# EAGLE design Uebungsboard2017 (EAGLE 8.3.1)
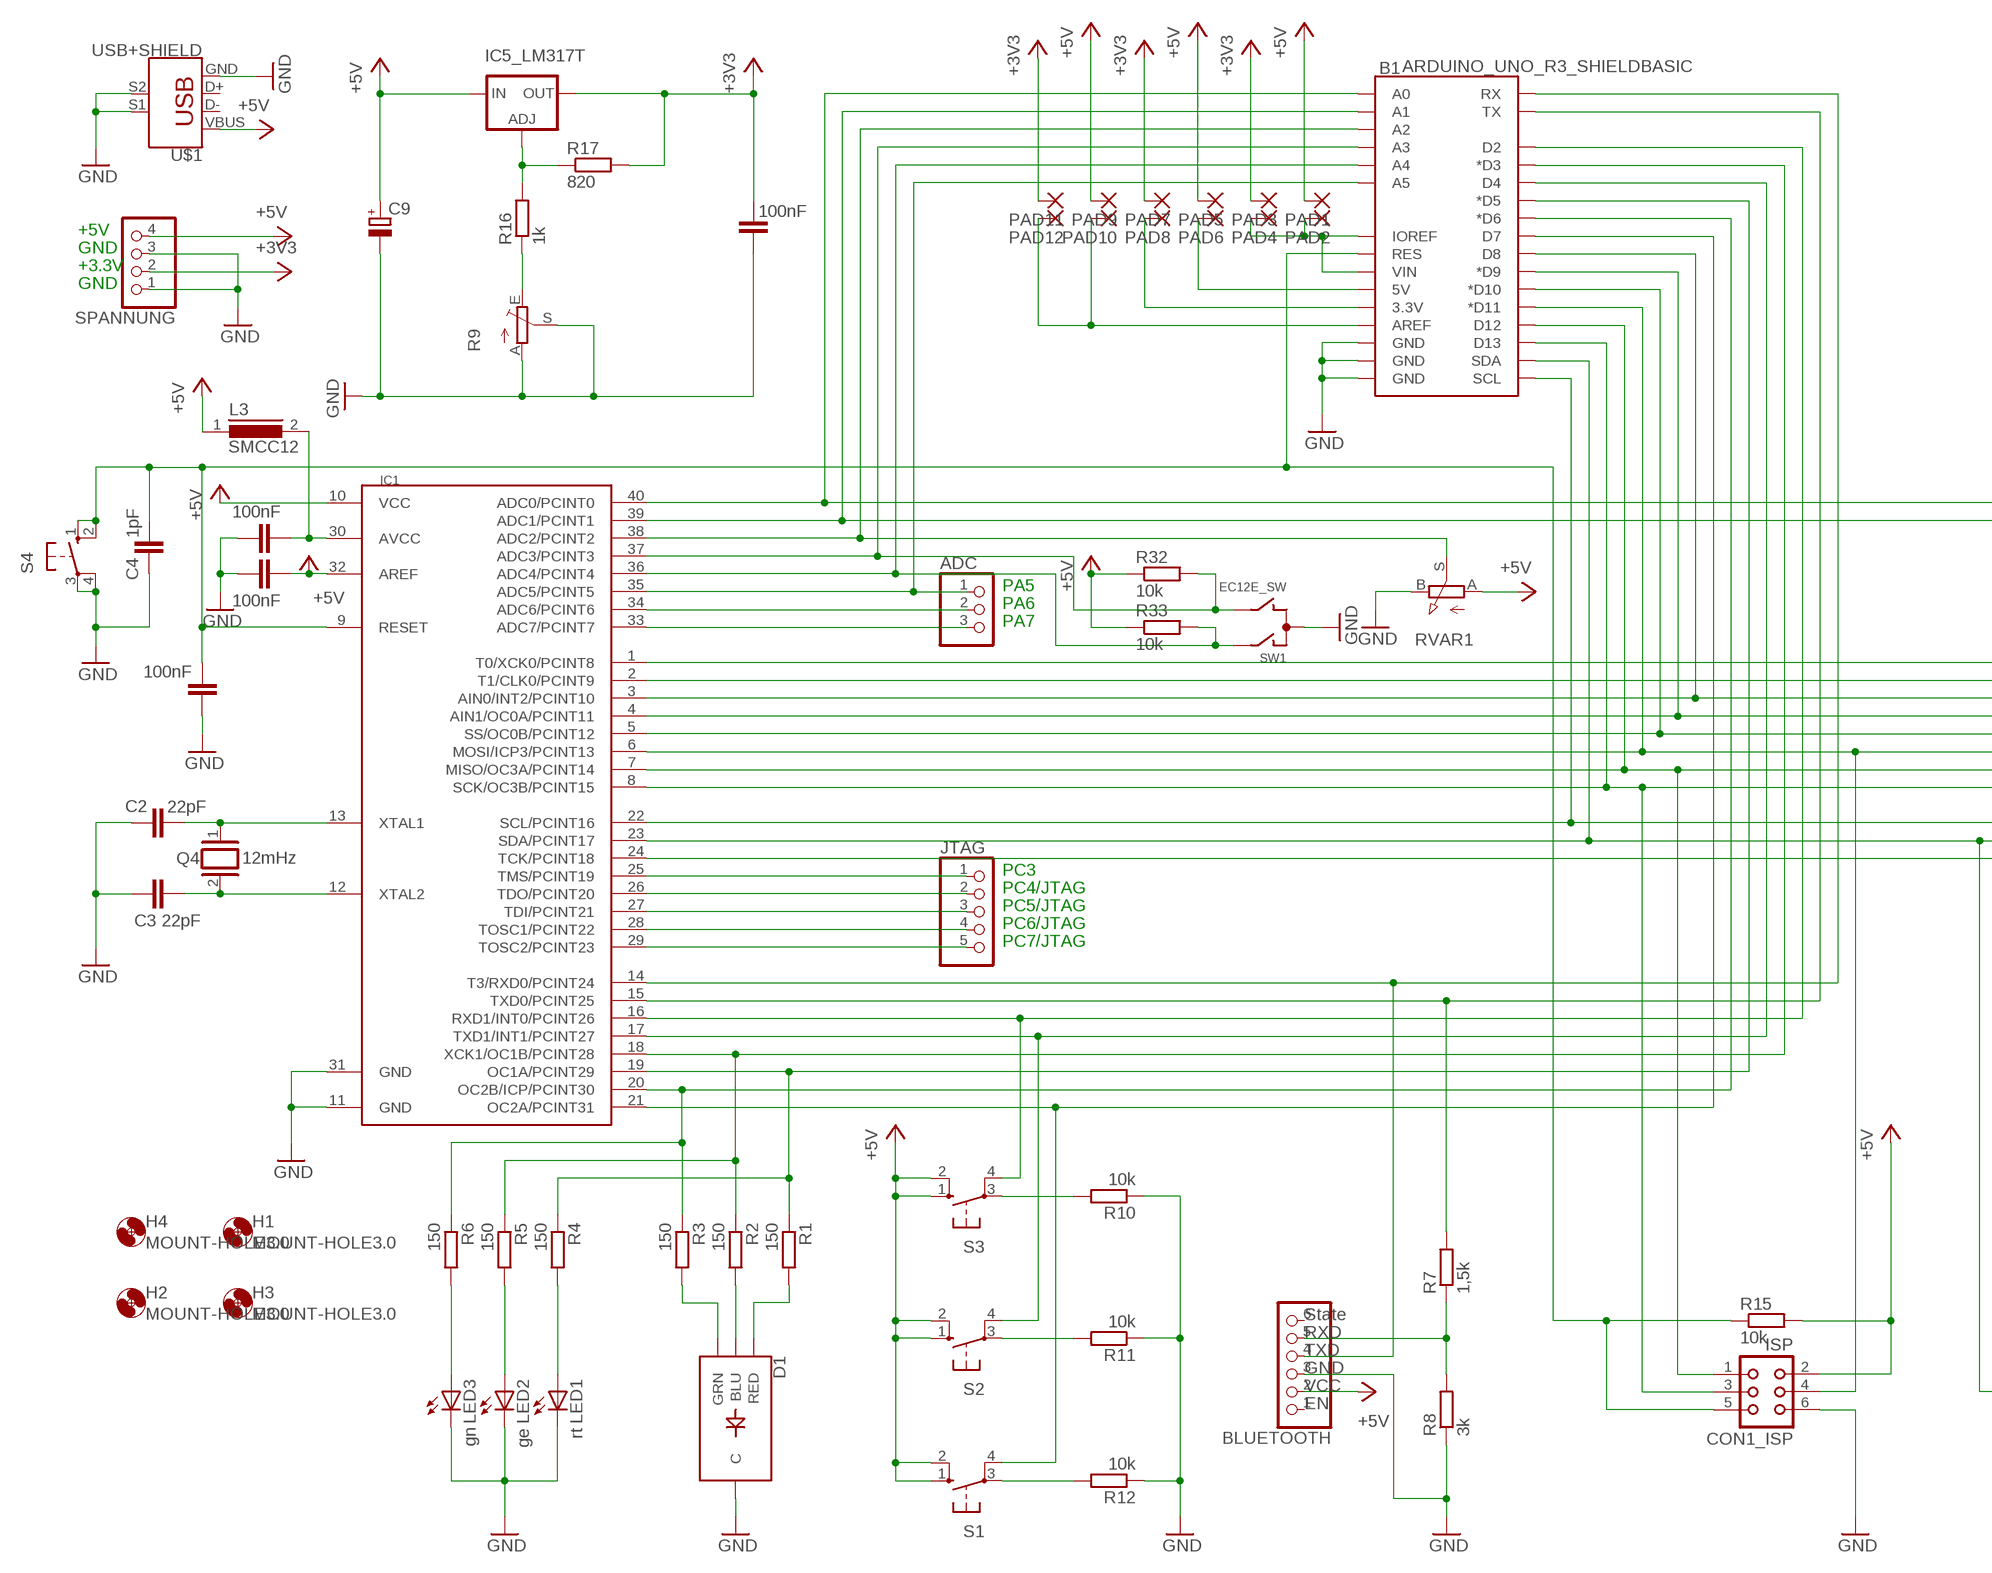
[diagram p0: schematic, sheet 1, part 1 of 2]
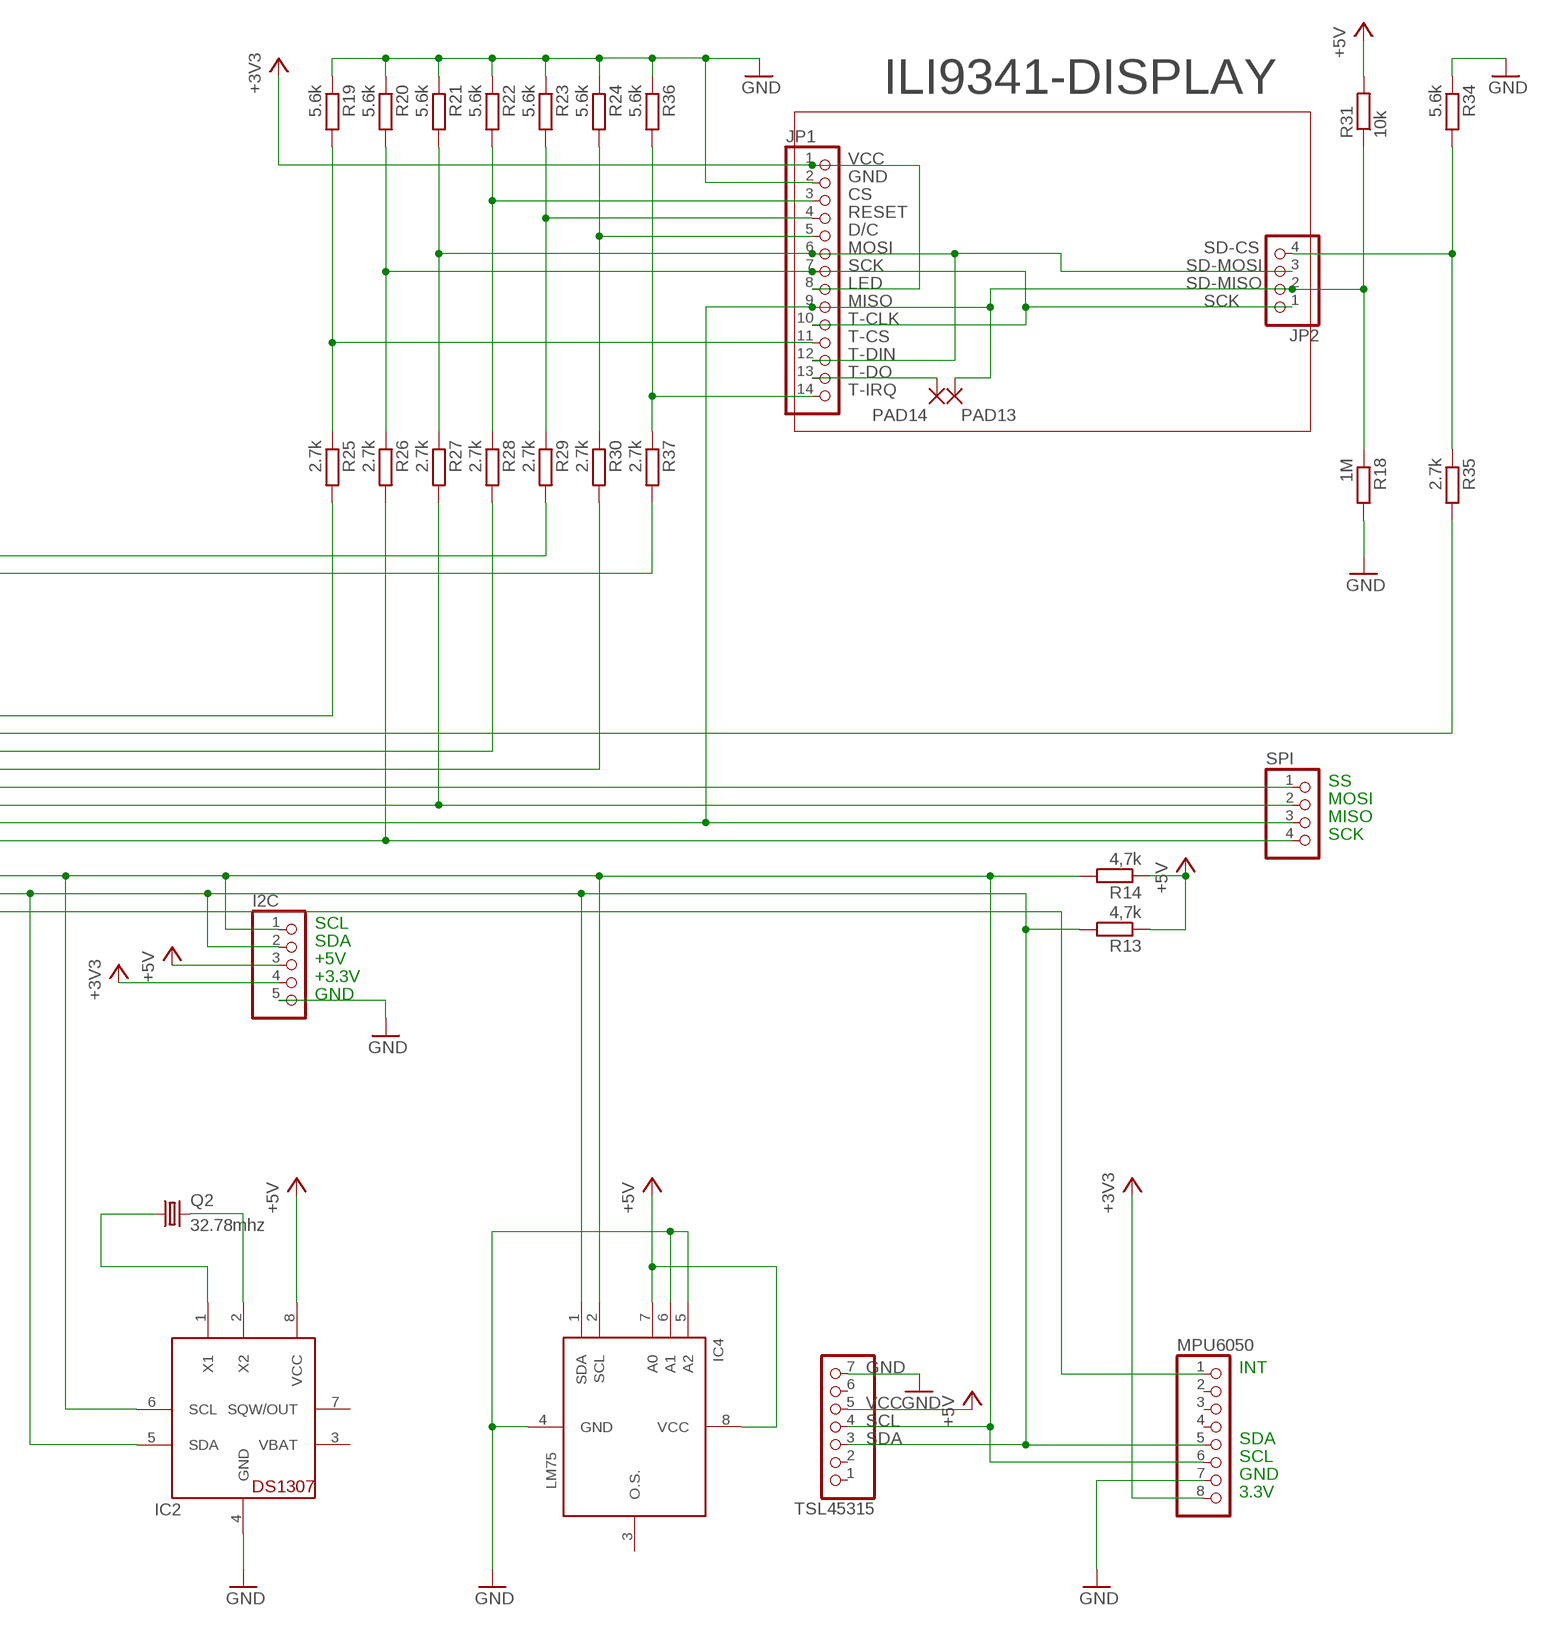
[diagram p1: schematic, sheet 1, part 2 of 2]

## Parts
ADC  PINHD-1X3  [1X03]
B1  ARDUINO_UNO_R3_SHIELDBASIC  [UNO_R3_SHIELD]
BLUETOOTH  PINHD-1X6  [1X06]
C2  22pF  C5/2.5  [C5B2.5]
C3  22pF  C5/2.5  [C5B2.5]
C4  1pF  C5/2.5  [C5B2.5]
C5  100nF  C5/2.5  [C5B2.5]
C6  100nF  C5/2.5  [C5B2.5]
C7  100nF  C5/2.5  [C5B2.5]
C8  100nF  C5/2.5  [C5B2.5]
C9  CPOL-EUE2-5  [E2-5]
CON1_ISP  ISP  CON06  [CON06]
D1  LED-RGB-CCTEST  [LED-RGB-THRU]
H1  MOUNT-HOLE3.0  [3,0]
H2  MOUNT-HOLE3.0  [3,0]
H3  MOUNT-HOLE3.0  [3,0]
H4  MOUNT-HOLE3.0  [3,0]
I2C  PINHD-1X5  [1X05]
IC1  MEGA1284P  [DIL40]
IC2  DS1307  [DIL08]
IC4  DS1721S  [SO-8]
IC5_LM317T  3.3V  LM317TS  [317TS]
JP1  PINHD-1X14  [1X14]
JP2  PINHD-1X4  [1X04]
JTAG  PINHD-1X5  [1X05]
L3  SMCC12  [SMCC12]
LED1  rt  LED5MM  [LED5MM]
LED2  ge  LED5MM  [LED5MM]
LED3  gn  LED5MM  [LED5MM]
MPU6050  PINHD-1X8  [1X08]
PAD1  1,6/0,8  [1,6/0,8]
PAD2  1,6/0,8  [1,6/0,8]
PAD3  1,6/0,8  [1,6/0,8]
PAD4  1,6/0,8  [1,6/0,8]
PAD5  1,6/0,8  [1,6/0,8]
PAD6  1,6/0,8  [1,6/0,8]
PAD7  1,6/0,8  [1,6/0,8]
PAD8  1,6/0,8  [1,6/0,8]
PAD9  1,6/0,8  [1,6/0,8]
PAD10  1,6/0,8  [1,6/0,8]
PAD11  1,6/0,8  [1,6/0,8]
PAD12  1,6/0,8  [1,6/0,8]
PAD13  1,6/0,8  [1,6/0,8]
PAD14  1,6/0,8  [1,6/0,8]
Q2  32.78mhz  CRYSTALTC26H  [TC26H]
Q4  12mHz  XTAL/S  [QS]
R1  150  R-EU_0207/10  [0207/10]
R2  150  R-EU_0207/10  [0207/10]
R3  150  R-EU_0207/10  [0207/10]
R4  150  R-EU_0207/10  [0207/10]
R5  150  R-EU_0207/10  [0207/10]
R6  150  R-EU_0207/10  [0207/10]
R7  1,5k  R-EU_0207/10  [0207/10]
R8  3k  R-EU_0207/10  [0207/10]
R9  TRIM_EU-S63P  [S63P]
R10  10k  R-EU_0207/10  [0207/10]
R11  10k  R-EU_0207/10  [0207/10]
R12  10k  R-EU_0207/10  [0207/10]
R13  4,7k  R-EU_0207/10  [0207/10]
R14  4,7k  R-EU_0207/10  [0207/10]
R15  10k  R-EU_0207/10  [0207/10]
R16  1k  R-EU_0207/10  [0207/10]
R17  820  R-EU_0207/10  [0207/10]
R18  1M  R-EU_0207/10  [0207/10]
R19  5.6k  R-EU_0207/10  [0207/10]
R20  5.6k  R-EU_0207/10  [0207/10]
R21  5.6k  R-EU_0207/10  [0207/10]
R22  5.6k  R-EU_0207/10  [0207/10]
R23  5.6k  R-EU_0207/10  [0207/10]
R24  5.6k  R-EU_0207/10  [0207/10]
R25  2.7k  R-EU_0207/10  [0207/10]
R26  2.7k  R-EU_0207/10  [0207/10]
R27  2.7k  R-EU_0207/10  [0207/10]
R28  2.7k  R-EU_0207/10  [0207/10]
R29  2.7k  R-EU_0207/10  [0207/10]
R30  2.7k  R-EU_0207/10  [0207/10]
R31  10k  R-EU_0207/10  [0207/10]
R32  10k  R-EU_0207/10  [0207/10]
R33  10k  R-EU_0207/10  [0207/10]
R34  5.6k  R-EU_0207/10  [0207/10]
R35  2.7k  R-EU_0207/10  [0207/10]
R36  5.6k  R-EU_0207/10  [0207/10]
R37  2.7k  R-EU_0207/10  [0207/10]
RVAR1  RK09K113  [RK09K113]
S1  10-XX  [B3F-10XX]
S2  10-XX  [B3F-10XX]
S3  10-XX  [B3F-10XX]
S4  10-XX  [B3F-10XX]
SPANNUNG  PINHD-1X4  [1X04]
SPI  PINHD-1X4  [1X04]
SW1  EC12E_SW  [ALPS_EC12E_SW]
TSL45315  PINHD-1X7  [1X07]
U$1  USB+SHIELD  [USB-B-PTH]

## Nets
+3V3: C5.1 I2C.4 IC5_LM317T.2(OUT) JP1.1 JP1.8 MPU6050.8 PAD3.1(P) PAD7.1(P) PAD11.1(P) R17.2 SPANNUNG.2
+5V: BLUETOOTH.2 C6.1 C9.+ CON1_ISP.2 I2C.3 IC1.10(VCC) IC1.32(AREF) IC2.8(VCC) IC4.7(A0) IC4.8(VCC) IC5_LM317T.3(IN) L3.1 PAD1.1(P) PAD5.1(P) PAD9.1(P) R13.1 R14.1 R15.2 R31.2 R32.1 R33.1 RVAR1.A S1.1(S) S1.2(S1) S2.1(S) S2.2(S1) S3.1(S) S3.2(S1) SPANNUNG.4 TSL45315.5 U$1.VBUS
GND: B1.GND@0(GND) B1.GND@1(GND) B1.GND@2(GND) BLUETOOTH.3 C2.2 C3.1 C4.2 C5.2 C6.2 C7.2 C8.2 C9.- CON1_ISP.6 D1.2(C) I2C.5 IC1.11(GND) IC1.31(GND) IC2.4(GND) IC4.4(GND) IC4.5(A2) IC4.6(A1) JP1.2 LED1.K(C) LED2.K(C) LED3.K(C) MPU6050.7 R8.1 R9.A R9.S R10.1 R11.1 R12.1 R18.2 R19.1 R20.1 R21.1 R22.1 R23.1 R24.1 R34.1 R36.1 RVAR1.B(E) S4.3(P) S4.4(P1) SPANNUNG.1 SPANNUNG.3 SW1.C TSL45315.7 U$1.GND U$1.S1 U$1.S2
N$1: B1.D5(*D5) IC1.19(OC1A/PCINT29) R1.1 R4.1
N$2: C2.1 IC1.13(XTAL1) Q4.1
N$3: B1.D3(*D3) IC1.18(XCK1/OC1B/PCINT28) R2.1 R5.1
N$4: C3.2 IC1.12(XTAL2) Q4.2
N$5: B1.D6(*D6) IC1.20(OC2B/ICP/PCINT30) R3.1 R6.1
N$6: D1.1(RED) R1.2
N$7: D1.4(BLU) R2.2
N$8: D1.3(GRN) R3.2
N$9: LED1.A R4.2
N$10: LED2.A R5.2
N$11: LED3.A R6.2
N$12: B1.D12 CON1_ISP.1 IC1.7(MISO/OC3A/PCINT14) JP1.9 JP2.2 PAD13.1(P) R18.1 R31.1 SPI.3
N$13: ADC.1 B1.A5 IC1.35(ADC5/PCINT5)
N$14: IC2.2(X2) Q2.2
N$15: B1.D11(*D11) CON1_ISP.4 IC1.6(MOSI/ICP3/PCINT13) R27.2 SPI.2
N$16: B1.A1 IC1.39(ADC1/PCINT1) R37.2
N$17: IC1.24(TCK/PCINT18) MPU6050.1
N$18: B1.A2 IC1.38(ADC2/PCINT2) RVAR1.S
N$19: IC5_LM317T.1(ADJ) R16.2 R17.1
N$20: IC2.1(X1) Q2.1
N$21: B1.RX BLUETOOTH.4 IC1.14(T3/RXD0/PCINT24)
N$22: BLUETOOTH.5 R7.1 R8.2
N$23: B1.SCL I2C.1 IC1.22(SCL/PCINT16) IC2.6(SCL) IC4.2(SCL) MPU6050.6 R14.2 TSL45315.4
N$24: B1.D4 IC1.17(TXD1/INT1/PCINT27) S2.4(P1)
N$25: B1.D2 IC1.16(RXD1/INT0/PCINT26) S3.4(P1)
N$26: R10.2 S3.3(P)
N$27: R11.2 S2.3(P)
N$28: R12.2 S1.3(P)
N$29: C7.1 IC1.30(AVCC) L3.2
N$30: B1.TX IC1.15(TXD0/PCINT25) R7.2
N$31: JP1.11 R19.2 R25.1
N$32: IC1.25(TMS/PCINT19) JTAG.1
N$33: R9.E R16.1
N$34: JP1.7 JP1.10 JP2.1 R20.2 R26.1
N$35: JP1.6 JP1.12 JP2.3 R21.2 R27.1
N$36: JP1.3 R22.2 R28.1
N$37: JP1.4 R23.2 R29.1
N$38: JP1.5 R24.2 R30.1
N$39: B1.A4 IC1.36(ADC4/PCINT4) R33.2 SW1.A
N$40: IC1.1(T0/XCK0/PCINT8) R25.2
N$41: B1.D8 IC1.3(AIN0/INT2/PCINT10) R28.2
N$42: B1.A0 IC1.40(ADC0/PCINT0) R29.2
N$43: B1.D9(*D9) IC1.4(AIN1/OC0A/PCINT11) R30.2
N$44: B1.A3 IC1.37(ADC3/PCINT3) R32.2 SW1.B
N$45: JP2.4 R34.2 R35.1
N$46: IC1.2(T1/CLK0/PCINT9) R35.2
N$47: IC1.26(TDO/PCINT20) JTAG.2
N$48: IC1.27(TDI/PCINT21) JTAG.3
N$49: IC1.28(TOSC1/PCINT22) JTAG.4
N$50: B1.D13 CON1_ISP.3 IC1.8(SCK/OC3B/PCINT15) R26.2 SPI.4
N$52: B1.D10(*D10) IC1.5(SS/OC0B/PCINT12) SPI.1
N$53: B1.D7 IC1.21(OC2A/PCINT31) S1.4(P1)
N$54: IC1.29(TOSC2/PCINT23) JTAG.5
N$55: B1.IOREF B1.VIN PAD2.1(P) PAD4.1(P)
N$56: B1.5V PAD6.1(P)
N$57: B1.3.3V PAD8.1(P)
N$58: B1.AREF PAD10.1(P) PAD12.1(P)
N$59: ADC.2 IC1.34(ADC6/PCINT6)
N$60: ADC.3 IC1.33(ADC7/PCINT7)
N$61: JP1.13 PAD14.1(P)
N$62: B1.RES C4.1 C8.1 CON1_ISP.5 IC1.9(RESET) R15.1 S4.1(S) S4.2(S1)
N$63: JP1.14 R36.2 R37.1
N$64: B1.SDA I2C.2 IC1.23(SDA/PCINT17) IC2.5(SDA) IC4.1(SDA) MPU6050.5 R13.2 TSL45315.3
Unconnected: BLUETOOTH.1 BLUETOOTH.6 IC2.7(SQW/OUT) IC4.3(O.S.) MPU6050.2 MPU6050.3 MPU6050.4 SW1.D SW1.E SW1.GND1(G) SW1.GND2(G) TSL45315.1 TSL45315.2 TSL45315.6 U$1.D+ U$1.D-

## Notes on the sheet
- ILI9341-DISPLAY
- VCC
- GND
- CS
- RESET
- D/C
- MOSI | SD-CS
- SCK | SD-MOSI
- +5V | LED | SD-MISO
- GND | MISO | SCK
- +3.3V | T-CLK
- GND | T-CS
- T-DIN
- T-DO
- T-IRQ
- PA5
- PA6
- PA7
- SS
- MOSI
- MISO
- SCK
- PC3 | SCL
- PC4/JTAG | SDA
- PC5/JTAG | +5V
- PC6/JTAG | +3.3V
- PC7/JTAG | GND
- State | GND | INT
- RXD
- TXD | VCC
- GND | SCL
- VCC | SDA | SDA
- EN | SCL
- GND
- 3.3V

## Power pins joined to a net without a drawn wire
VBAT: IC2.3(VBAT)

## Library data of the parts
ADC = pinhead:PINHD-1X3: PIN HEADER
B1 = SparkFun-Boards:ARDUINO_UNO_R3_SHIELD: Arduino R3 Shield Footprint Shield form compatible with the Arduino Uno R3. SparkFun Products: MG2639 Cellular Shield <https://www.sparkfun.com/products/13120> MIDI Shield <https://www.sparkfun.com/products/12898> R3 Stackable Headers Kit <https://www.sparkfun.com/products/11417>
BLUETOOTH = pinhead:PINHD-1X6: PIN HEADER
C2-C8 = capacitor-wima:C: CAPACITOR naming: grid - package width
C9 = rcl:CPOL-EU: POLARIZED CAPACITOR, European symbol
CON1_ISP = con-harting:CON06: CONNECTOR; OC_FARNELL: unknown; OC_NEWARK: unknown
D1 = SparkFun-LED3:LED-RGB-CC: LED-RGB Common Cathode Packages: LED RGB-THRU LED_PIRANHA_5MM SparkFun Products: RGB Diffused Common Cathode- Diffuse <[https://www.sparkfun.com/products/9264]> RGB Diffused Common Cathode - Clear <[https://www.sparkfun.com/products/105]> LED-RGB 5mm Square (Piranha) <[https://www.sparkfun.com/products/11679]>
H1-H4 = holes:MOUNT-HOLE: MOUNTING HOLE with drill center marker
I2C JTAG = pinhead:PINHD-1X5: PIN HEADER
IC1 = 1284p:MEGA1284P: Atmel ATmega1284P 8-bit AVR Microcontroller
IC2 = adafruit:DS1307: DS1307 Real time clock (RTC) with battery backup ability. Talk to it via i2c
IC4 = LM75:DS1721: Temperatursensor / Thermostat mit I²C-Interface
IC5_LM317T = v-reg:LM317TS: VOLTAGE REGULATOR
JP1 = pinhead:PINHD-1X14: PIN HEADER
JP2 SPANNUNG SPI = pinhead:PINHD-1X4: PIN HEADER
L3 = inductors:SMCC12: INDUCTOR
LED1-LED3 = led:LED: LED OSRAM: - CHIPLED LG R971, LG N971, LY N971, LG Q971, LY Q971, LO R971, LY R971 LH N974, LH R974 LS Q976, LO Q976, LY Q976 LO Q996 - Hyper CHIPLED LW Q18S LB Q993, LB Q99A, LB R99A - SideLED LS A670, LO A670, LY A670, LG A670, LP A670 LB A673, LV A673, LT A673, LW A673 LH A674 LY A675 LS A676, LA A676, LO A676, LY A676, LW A676 LS A679, LY A679, LG A679 - Hyper Micro SIDELED® LS Y876, LA Y876, LO Y876, LY Y876 LT Y87S - SmartLED LW L88C, LW L88S LB L89C, LB L89S, LG L890 LS L89K, LO L89K, LY L89K LS L896, LA L896, LO L896, LY L896 - TOPLED LS T670, LO T670, LY T670, LG T670, LP T670 LSG T670, LSP T670, LSY T670, LOP T670, LYG T670 LG T671, LOG T671, LSG T671 LB T673, LV T673, LT T673, LW T673 LH T674 LS T676, LA T676, LO T676, LY T676, LB T676, LH T676, LSB T676, LW T676 LB T67C, LV T67C, LT T67C, LS T67K, LO T67K, LY T67K, LW E67C LS E67B, LA E67B, LO E67B, LY E67B, LB E67C, LV E67C, LT E67C LW T67C LS T679, LY T679, LG T679 LS T770, LO T770, LY T770, LG T770, LP T770 LB T773, LV T773, LT T773, LW T773 LH T774 LS E675, LA E675, LY E675, LS T675 LS T776, LA T776, LO T776, LY T776, LB T776 LHGB T686 LT T68C, LB T68C - Hyper Mini TOPLED® LB M676 - Mini TOPLED Santana® LG M470 LS M47K, LO M47K, LY M47K Source: http://www.osram.convergy.de LUXEON: - LUMILED® LXK2-PW12-R00, LXK2-PW12-S00, LXK2-PW14-U00, LXK2-PW14-V00 LXK2-PM12-R00, LXK2-PM12-S00, LXK2-PM14-U00 LXK2-PE12-Q00, LXK2-PE12-R00, LXK2-PE12-S00, LXK2-PE14-T00, LXK2-PE14-U00 LXK2-PB12-K00, LXK2-PB12-L00, LXK2-PB12-M00, LXK2-PB14-N00, LXK2-PB14-P00, LXK2-PB14-Q00 LXK2-PR12-L00, LXK2-PR12-M00, LXK2-PR14-Q00, LXK2-PR14-R00 LXK2-PD12-Q00, LXK2-PD12-R00, LXK2-PD12-S00 LXK2-PH12-R00, LXK2-PH12-S00 LXK2-PL12-P00, LXK2-PL12-Q00, LXK2-PL12-R00 Source: www.luxeon.com KINGBRIGHT: KA-3528ASYC Source: www.kingbright.com
MPU6050 = pinhead:PINHD-1X8: PIN HEADER
PAD1-PAD14 = wirepad:1,6/0,8: THROUGH-HOLE PAD
Q2 = adafruit:CRYSTAL: CRYSTAL; OC_FARNELL: unknown; OC_NEWARK: unknown
Q4 = special:XTAL/S: CRYSTAL
R1-R8 R10-R37 = rcl:R-EU_: RESISTOR, European symbol
R9 = pot:TRIM_EU-: POTENTIOMETER
RVAR1 = alps-potentiometers:RK09K113: Alps RK09K113 Series. Single Unit. Vertical Type. Snap In Print Montage Supplier www.reichelt.de datasheet <http://www.alps.com/WebObjects/catalog.woa/E/PDF/Potentiometer/InsulatedShaft/RK09K/RK09K.PDF> Author M.Ebel xebo87@gmail.com Discussion <http://www.mikrocontroller.net/topic/331595>
S1-S4 = switch-omron:10-XX: OMRON SWITCH; MPN: B3F-1000; OC_FARNELL: 176432; OC_NEWARK: 36M3542
SW1 = switch-alps:EC12E_SW: ALPS rotary Encoder EC12E series with switch; MPN: EC12E2424407; OC_FARNELL: 1520813; OC_NEWARK: 74M1068
TSL45315 = pinhead:PINHD-1X7: PIN HEADER
U$1 = SparkFun-Retired:USB+SHIELD: USB+Shield USB connector with shield pins connectable

## Board
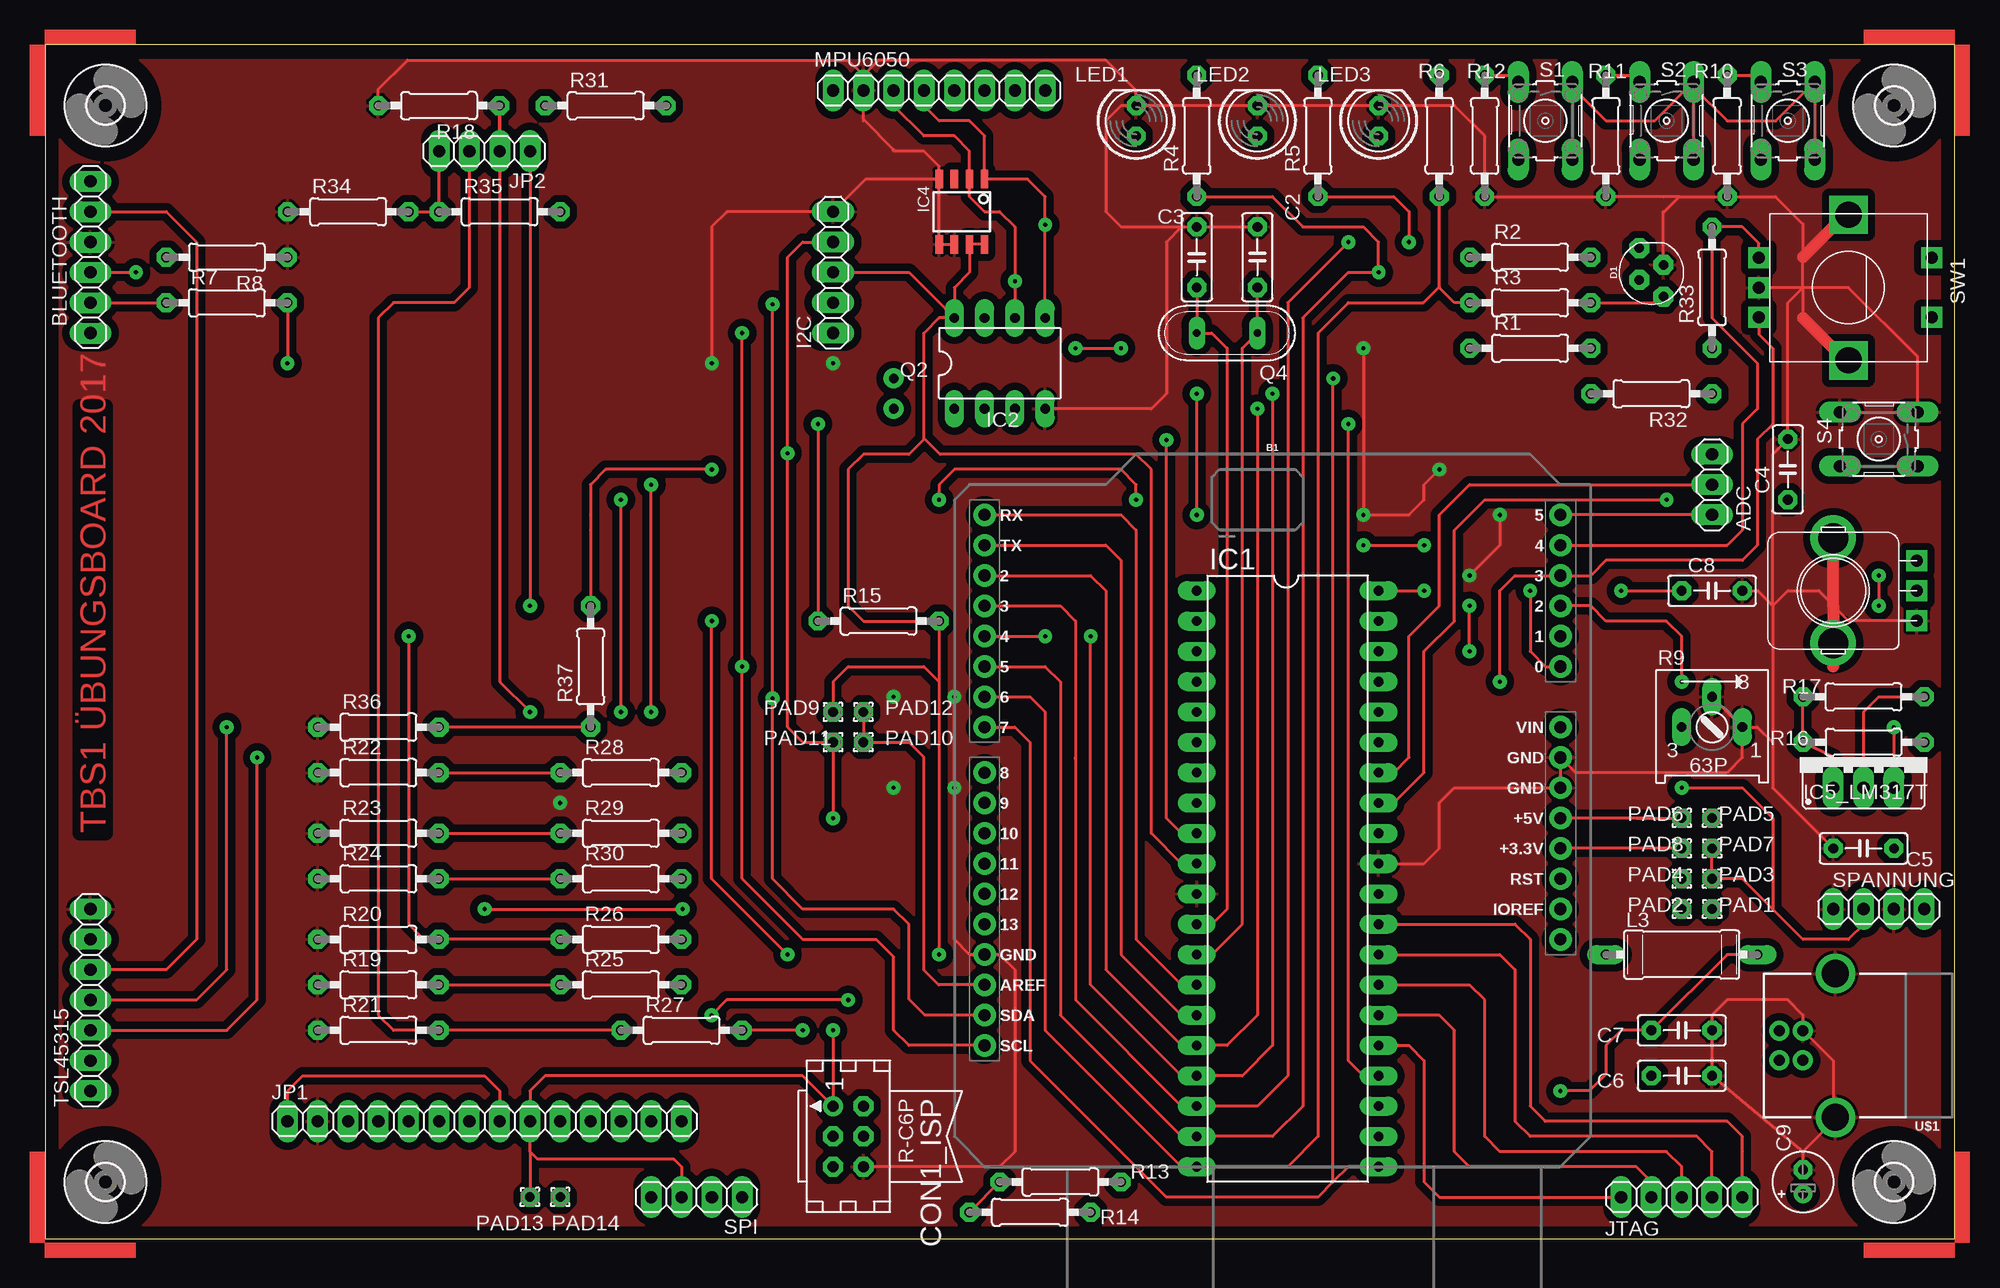
[diagram p2: board, top side]
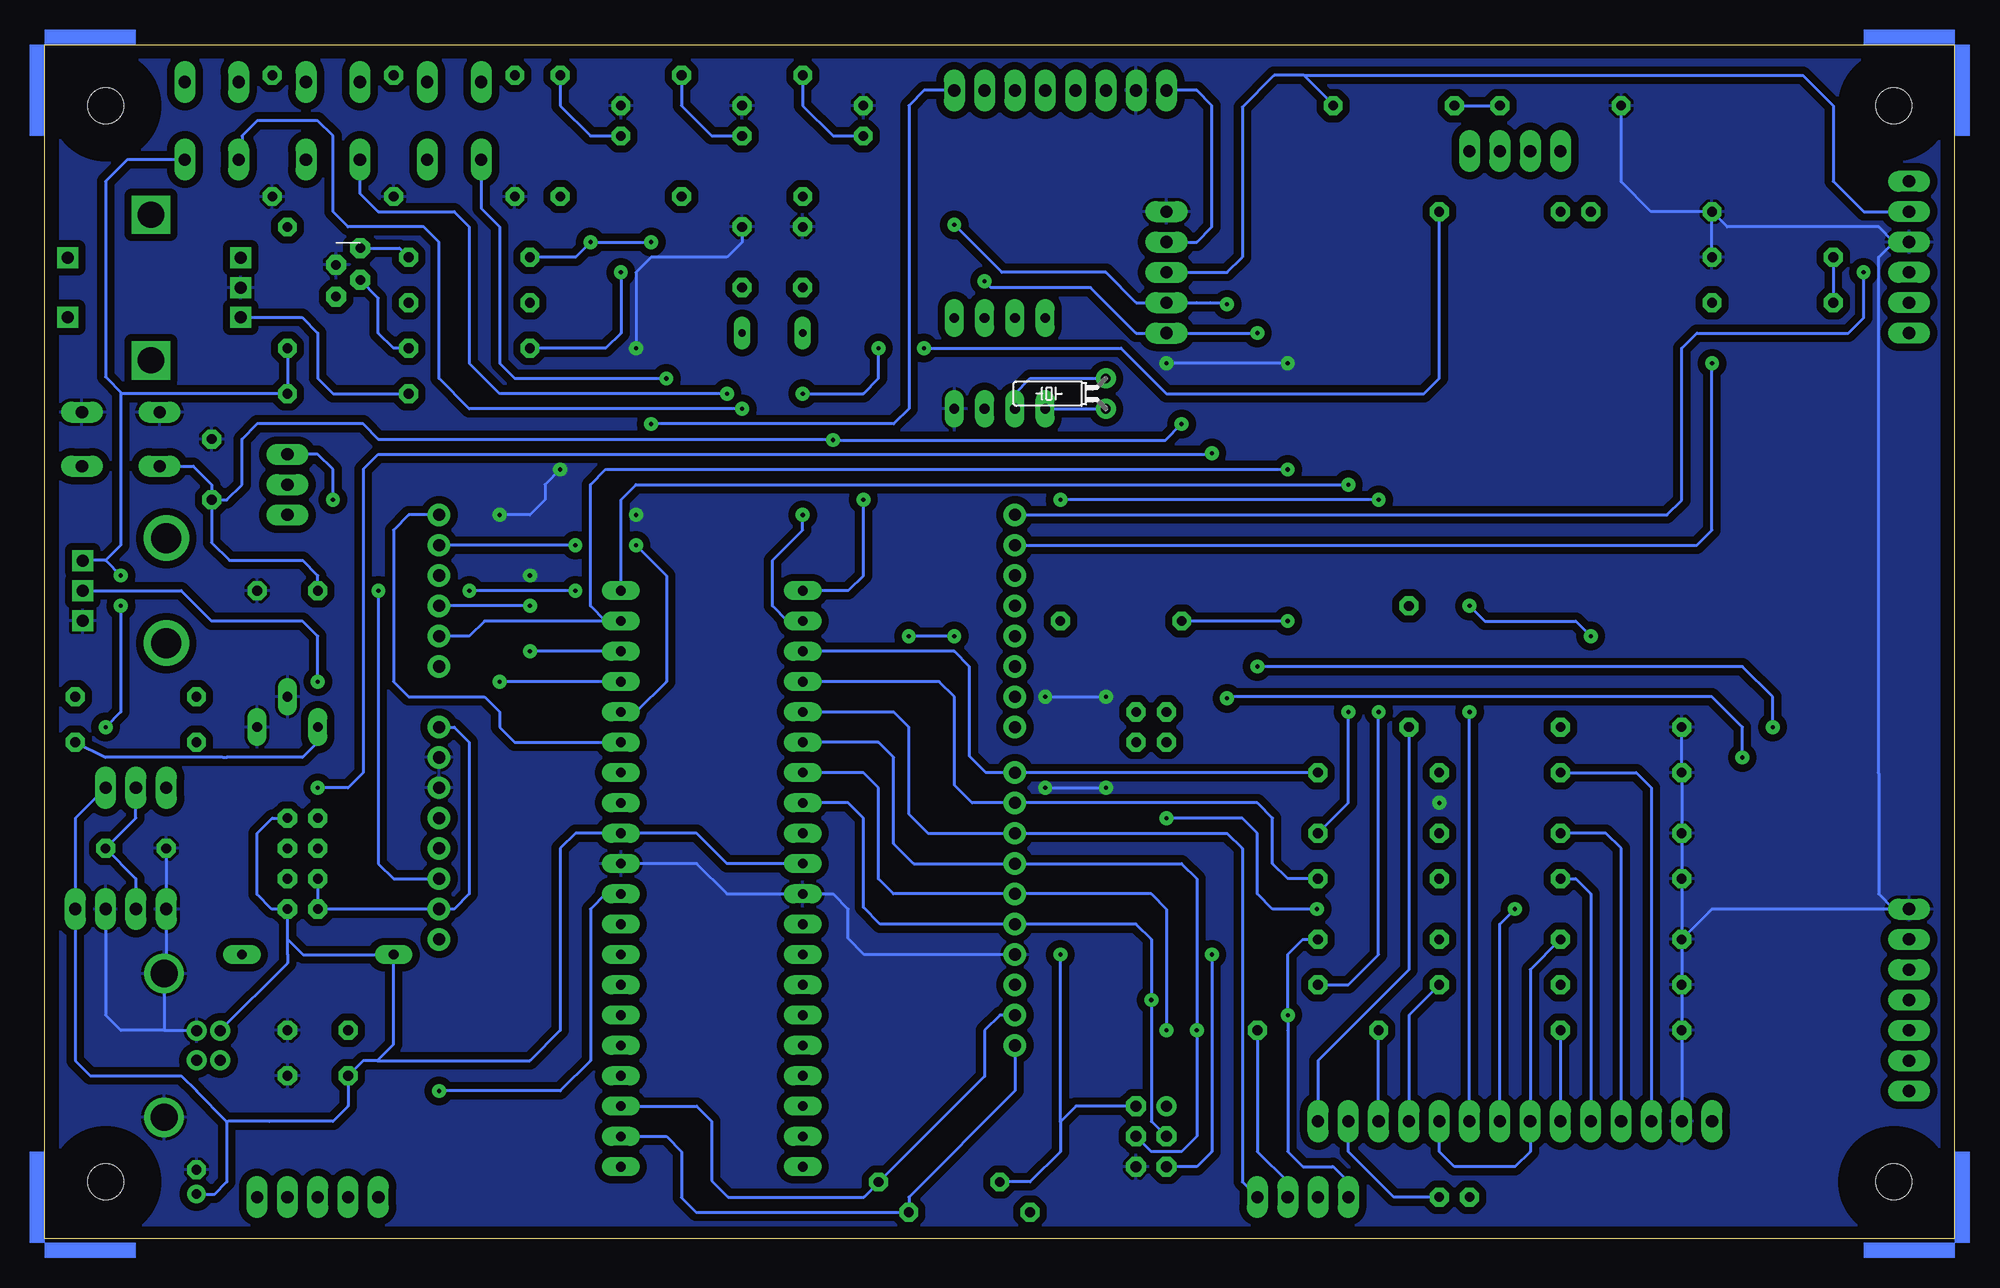
[diagram p3: board, bottom side, seen from below]

Size 160 x 100 mm. Coordinates in mm from the lower left corner, seen from the top.
Outline: 160,100 0,100 0,0 160,0 160,100
Copper layers (1*16): Top 0.035mm / dielectric 1.5mm / Bottom 0.035mm
Design rules "default *": minimum track width 6mil, minimum drill 0.35mm, track to track 6mil, track to pad 6mil, pad to pad 6mil, via to via 6mil, smd to smd 6mil, copper to edge 40mil, drill to drill 6mil, minimum pad ring 15mil, minimum via ring 16mil, stop-mask expansion 4mil, vias tented up to drill 0mil, thermal gap 10mil

### Footprints (pad centres in the part's own frame; a part is rotated, then mirrored left to right if it is on the bottom)
1X03 = drill 1.016 long: 1 -2.54,0; 2 0,0; 3 2.54,0
UNO_R3_SHIELD = drill 1.016 pad 1.88: 3.3V 24.13,-2.54; 5V 24.13,0; A0 24.13,12.7; A1 24.13,15.24; A2 24.13,17.78; A3 24.13,20.32; A4 24.13,22.86; A5 24.13,25.4; AREF -24.13,-13.97; D2 -24.13,20.32; D3 -24.13,17.78; D4 -24.13,15.24; D5 -24.13,12.7; D6 -24.13,10.16; D7 -24.13,7.62; D8 -24.13,3.81; D9 -24.13,1.27; D10 -24.13,-1.27; D11 -24.13,-3.81; D12 -24.13,-6.35; D13 -24.13,-8.89; GND@0 24.13,2.54; GND@1 24.13,5.08; GND@2 -24.13,-11.43; IOREF 24.13,-7.62; NC 24.13,-10.16; RES 24.13,-5.08; RX -24.13,25.4; SCL -24.13,-19.05; SDA -24.13,-16.51; TX -24.13,22.86; VIN 24.13,7.62
1X06 = drill 1.016 long: 1 -6.35,0; 2 -3.81,0; 3 -1.27,0; 4 1.27,0; 5 3.81,0; 6 6.35,0
C5B2.5 = drill 0.813 pad 1.6 octagon: 1 -2.54,0; 2 2.54,0
E2-5 = drill 0.813 pad 1.27: + -1.016,0 | drill 0.813 pad 1.27 octagon: - 1.016,0
CON06 = drill 0.914: 1 -2.54,-1.27 | drill 0.914 octagon: 2 -2.54,1.27; 3 0,-1.27; 4 0,1.27; 5 2.54,-1.27; 6 2.54,1.27
LED-RGB-THRU = drill 0.8 pad 1.676 octagon: 1 -0.635,1.016; 2 0.635,-1.016; 3 -2.032,-1.016; 4 2.032,1.016
3,0 = hole 3: 0,0
1X05 = drill 1.016 long: 1 -5.08,0; 2 -2.54,0; 3 0,0; 4 2.54,0; 5 5.08,0
DIL40 = drill 0.813 long: 1 -24.13,-7.62; 2 -21.59,-7.62; 3 -19.05,-7.62; 4 -16.51,-7.62; 5 -13.97,-7.62; 6 -11.43,-7.62; 7 -8.89,-7.62; 8 -6.35,-7.62; 9 -3.81,-7.62; 10 -1.27,-7.62; 11 1.27,-7.62; 12 3.81,-7.62; 13 6.35,-7.62; 14 8.89,-7.62; 15 11.43,-7.62; 16 13.97,-7.62; 17 16.51,-7.62; 18 19.05,-7.62; 19 21.59,-7.62; 20 24.13,-7.62; 21 24.13,7.62; 22 21.59,7.62; 23 19.05,7.62; 24 16.51,7.62; 25 13.97,7.62; 26 11.43,7.62; 27 8.89,7.62; 28 6.35,7.62; 29 3.81,7.62; 30 1.27,7.62; 31 -1.27,7.62; 32 -3.81,7.62; 33 -6.35,7.62; 34 -8.89,7.62; 35 -11.43,7.62; 36 -13.97,7.62; 37 -16.51,7.62; 38 -19.05,7.62; 39 -21.59,7.62; 40 -24.13,7.62
DIL08 = drill 0.813 long: 1 -3.81,-3.81; 2 -1.27,-3.81; 3 1.27,-3.81; 4 3.81,-3.81; 5 3.81,3.81; 6 1.27,3.81; 7 -1.27,3.81; 8 -3.81,3.81
SO-8 = smd 0.61 x 1.524: 1 -1.27,-2.743; 2 0,-2.743; 3 1.27,-2.743; 4 2.54,-2.743; 5 2.54,2.743; 6 1.27,2.743; 7 0,2.743; 8 -1.27,2.743
317TS = drill 1.016 long: 1 -2.54,-2.54; 2 0,-2.54; 3 2.54,-2.54
1X14 = drill 1.016 long: 1 -16.51,0; 2 -13.97,0; 3 -11.43,0; 4 -8.89,0; 5 -6.35,0; 6 -3.81,0; 7 -1.27,0; 8 1.27,0; 9 3.81,0; 10 6.35,0; 11 8.89,0; 12 11.43,0; 13 13.97,0; 14 16.51,0
1X04 = drill 1.016 long: 1 -3.81,0; 2 -1.27,0; 3 1.27,0; 4 3.81,0
SMCC12 = drill 0.813 long: 1 -6.35,0; 2 6.35,0
LED5MM = drill 0.813 octagon: A -1.27,0; K 1.27,0
1X08 = drill 1.016 long: 1 -8.89,0; 2 -6.35,0; 3 -3.81,0; 4 -1.27,0; 5 1.27,0; 6 3.81,0; 7 6.35,0; 8 8.89,0
1,6/0,8 = drill 0.813 pad 1.6 octagon: 1 0,0
TC26H = drill 0.813 pad 1.676: 1 -1.27,0; 2 1.27,0
QS = drill 0.61 long: 1 -2.54,0; 2 2.54,0
0207/10 = drill 0.813 octagon: 1 -5.08,0; 2 5.08,0
S63P = drill 0.813 long: A 2.54,0; E -2.54,0; S 0,2.54
RK09K113 = drill 1 square: A 2.5,-7; B -2.5,-7; S 0,-7 | drill 2.5 pad 3.81: P$1 -4.4,0; P$2 4.4,0
B3F-10XX = drill 1.016 long: 1 -3.251,2.261; 2 3.251,2.261; 3 -3.251,-2.261; 4 3.251,-2.261
ALPS_EC12E_SW = drill 1 square: A -2.5,-7.5; B 2.5,-7.5; C 0,-7.5; D -2.5,7; E 2.5,7 | drill 2.2 square: GND1 -6.1,0; GND2 6.1,0
1X07 = drill 1.016 long: 1 -7.62,0; 2 -5.08,0; 3 -2.54,0; 4 0,0; 5 2.54,0; 6 5.08,0; 7 7.62,0
USB-B-PTH = drill 0.914 pad 1.676: D+ 0,1.25; D- 1.981,1.25; GND 0,-1.25; VBUS 1.981,-1.25 | drill 2.286: S1 -2.718,-6.02; S2 -2.718,6.02

### Placement (x,y rotation side)
ADC  139.68,63.17 90 top
B1  102.85,35.23 0 top
BLUETOOTH  3.79,82.22 270 top
C2  101.58,82.22 90 top
C3  96.5,82.22 270 top
C4  146.03,64.44 90 top
C5  152.38,32.69 180 top
C6  137.14,13.64 0 top
C7  137.14,17.45 0 top
C8  139.68,54.28 0 top
C9  147.3,4.75 90 top
CON1_ISP  67.29,8.56 270 top
D1  134.6,80.95 90 top
H1  5.06,4.75 0 top
H2  5.06,94.92 0 top
H3  154.92,94.92 0 top
H4  154.92,4.75 0 top
I2C  66.02,80.95 90 top
IC1  104.12,30.15 270 top
IC2  79.99,73.33 0 top
IC4  77.45,86.03 180 top
IC5_LM317T  152.38,40.31 0 top
JP1  36.81,9.83 0 top
JP2  36.81,91.11 180 top
JTAG  137.14,3.48 0 top
L3  137.14,23.8 0 top
LED1  91.42,93.65 90 top
LED2  101.58,93.65 90 top
LED3  111.74,93.65 90 top
MPU6050  74.91,96.19 180 top
PAD1  139.68,27.61 0 top
PAD2  137.14,27.61 0 top
PAD3  139.68,30.15 0 top
PAD4  137.14,30.15 0 top
PAD5  139.68,35.23 0 top
PAD6  137.14,35.23 0 top
PAD7  139.68,32.69 0 top
PAD8  137.14,32.69 0 top
PAD9  66.02,44.12 0 top
PAD10  68.56,41.58 0 top
PAD11  66.02,41.58 0 top
PAD12  68.56,44.12 0 top
PAD13  40.62,3.48 0 top
PAD14  43.16,3.48 0 top
Q2  71.1,70.79 90 bottom
Q4  99.04,75.87 180 top
R1  124.44,74.6 0 top
R2  124.44,82.22 0 top
R3  124.44,78.41 0 top
R4  96.5,92.38 90 top
R5  106.66,92.38 90 top
R6  116.82,92.38 90 top
R7  15.22,78.41 0 top
R8  15.22,82.22 180 top
R9  139.68,42.85 0 top
R10  140.95,92.38 90 top
R11  130.79,92.38 90 top
R12  120.63,92.38 90 top
R13  85.07,4.75 0 top
R14  82.53,2.21 0 top
R15  69.83,51.74 0 top
R16  152.38,41.58 180 top
R17  152.38,45.39 0 top
R18  33,94.92 180 top
R19  27.92,21.26 0 top
R20  27.92,25.07 0 top
R21  27.92,17.45 0 top
R22  27.92,39.04 0 top
R23  27.92,33.96 0 top
R24  27.92,30.15 0 top
R25  48.24,21.26 0 top
R26  48.24,25.07 0 top
R27  53.32,17.45 0 top
R28  48.24,39.04 0 top
R29  48.24,33.96 0 top
R30  48.24,30.15 0 top
R31  46.97,94.92 0 top
R32  134.6,70.79 180 top
R33  139.68,79.68 90 top
R34  25.38,86.03 0 top
R35  38.08,86.03 0 top
R36  27.92,42.85 0 top
R37  45.7,47.93 90 top
RVAR1  149.84,54.28 90 top
S1  125.71,93.65 270 top
S2  135.87,93.65 270 top
S3  146.03,93.65 270 top
S4  153.65,66.98 180 top
SPANNUNG  153.65,27.61 0 top
SPI  54.59,3.48 180 top
SW1  151.11,79.68 270 top
TSL45315  3.79,19.99 90 top
U$1  147.3,16.18 180 top
U$2  [ANGLE-ARROW-NW1]  160,100 270 top
U$3  [ANGLE-ARROW-NW1]  160,-0.33 180 top
U$4  [ANGLE-ARROW-NW1]  -0.02,-0.33 90 top
U$5  [ANGLE-ARROW-NW1]  -0.02,100 0 top
U$6  [ANGLE-ARROW-NW1-16]  160,100 270 top
U$7  [ANGLE-ARROW-NW1-16]  160,-0.33 180 top
U$8  [ANGLE-ARROW-NW1-16]  -0.02,-0.33 90 top
U$9  [ANGLE-ARROW-NW1-16]  -0.02,100 0 top

### Tracks (layer width: path | path; a pad name or v marks a point on that pad's centre or on a via)
+3V3  (via drill 0.35)
  Top 0.254: IC5_LM317T.2 152.38,44.12 153.65,45.39 R17.2 | SPANNUNG.2 152.38,26.34 151.11,25.07 147.3,25.07 144.76,27.61 | I2C.4 63.48,83.49 62.21,82.22 v62.21,65.8 62.21,42.85 63.48,41.58 PAD11.1 v66.02,35.23 | 144.76,27.61 142.22,30.15 PAD3.1 PAD7.1 | v137.14,37.77 142.22,37.77 144.76,35.23 144.76,27.61 | JP1.1 20.3,12.37 21.57,13.64 36.81,13.64 38.08,12.37 JP1.8 | v36.81,27.61 v53.4,27.61
  Bottom 0.254: SPANNUNG.2 152.38,30.15 C5.1 152.38,35.23 IC5_LM317T.2 | v137.14,37.77 134.6,37.77 133.33,39.04 133.33,64.44 132.06,65.71 62.3,65.71 v62.21,65.8 | v53.4,27.61 57.13,27.61 58.4,28.88 58.4,33.96 59.67,35.23 v66.02,35.23 | JP1.8 38.08,26.34 v36.81,27.61 | I2C.4 63.48,83.49 62.21,84.76 62.21,94.92 63.48,96.19 MPU6050.8
+5V  (via drill 0.35)
  Top 0.254: S2.1 134.88,93.65 130.79,93.65 127.97,96.47 S1.1 S1.2 | S2.1 138.13,96.47 140.95,93.65 145.04,93.65 S3.1 S3.2 | S2.1 S2.2 | R13.1 R14.1 | IC4.8 IC4.7 77.45,80.95 76.18,79.68 IC2.8 | IC2.8 74.91,77.14 73.64,75.87 73.64,67.06 | IC1.10 95.23,31.42 92.69,33.96 92.69,64.44 91.42,65.71 74.99,65.71 73.64,67.06 | 74.91,46.66 v74.91,23.8 | I2C.3 72.37,80.95 IC2.8 | PAD9.1 66.02,46.66 67.29,47.93 73.64,47.93 74.91,46.66 | 74.91,46.66 R15.2 68.56,51.74 67.29,53.01 67.29,64.44 68.56,65.71 72.37,65.71 73.64,66.98 73.64,67.06 | TSL45315.5 10.14,22.53 12.68,25.07 12.68,83.49 10.14,86.03 BLUETOOTH.2 | v153.65,55.55 v153.65,53.01 | v154.92,42.85 IC5_LM317T.3
  Bottom 0.254: IC5_LM317T.3 157.46,35.23 SPANNUNG.4 157.46,14.91 156.19,13.64 148.57,13.64 147.3,12.37 147.3,12.35 144.76,9.81 144.76,9.73 | I2C.3 60.94,80.95 59.67,82.22 59.67,94.8 57.01,97.46 54.49,97.46 | 74.91,9.78 v74.91,23.8 | PAD5.1 140.95,35.23 142.22,33.96 142.22,28.83 141,27.61 PAD1.1 139.68,25.07 | CON1_ISP.2 73.64,11.1 73.64,11.05 74.91,9.78 | 74.91,9.78 74.91,7.29 77.45,4.75 R13.1 | 153.52,70.79 153.65,70.79 153.65,58.09 154.92,56.82 | S3.2 153.09,90.4 154.92,88.57 154.92,72.19 153.52,70.79 | 153.52,70.79 R32.1 R33.1 | 139.68,23.83 139.68,23.08 U$1.VBUS | 139.68,23.83 139.68,25.07 | 139.65,23.8 139.68,23.83 | 139.68,25.07 139.65,25.07 138.38,23.8 L3.1 130.79,16.29 132.17,14.91 | 154.92,56.82 156.8,56.82 RVAR1.A | BLUETOOTH.2 7.6,86.03 10.14,88.57 10.14,94.92 12.68,97.46 54.49,97.46 | R31.2 52.05,95.02 54.49,97.46 | C9.+ 145.78,3.73 144.76,4.75 144.76,9.73 | IC1.10 102.85,31.42 105.39,33.96 IC1.32 115.55,33.96 116.82,32.69 116.82,17.45 119.36,14.91 132.17,14.91 | 154.92,56.82 v153.65,55.55 | v153.65,53.01 153.65,44.12 v154.92,42.85 | 132.17,14.91 133.33,14.91 C6.1 134.6,11.1 135.87,9.83 141.18,9.83 | 141.18,9.83 141.19,9.82 | 141.18,9.83 144.66,9.83 144.76,9.73
GND  (via drill 0.35)
  Top 0.254: C5.2 144.76,37.77 144.76,41.56 | 147.3,79.68 SW1.C | LED1.K LED2.K LED3.K 118.09,94.92 120.63,92.38 R12.1 R11.1 135.63,87.3 | LED1.K 91.42,96.19 88.88,98.73 69.83,98.73 68.56,97.46 | C2.2 C3.1 95.23,84.76 | LED1.K 90.15,94.92 88.88,93.65 88.88,86.03 90.15,84.76 95.23,84.76 | IC4.4 IC4.5 IC4.6 | IC4.4 68.76,88.77 I2C.5 57.13,86.03 55.86,84.76 v55.86,73.33 | 68.56,97.46 MPU6050.7 68.56,93.78 | 68.56,97.46 67.29,98.73 30.36,98.73 27.92,96.29 R18.2 | 68.56,93.78 68.56,93.65 | IC4.4 74.91,89.84 73.64,91.11 71.1,91.11 71.1,91.24 68.56,93.78 | 147.3,79.68 147.3,77.14 | 147.3,79.68 147.3,82.22 147.3,84.99 144.99,87.3 R10.1 136.96,87.3 | 147.3,79.68 | S4.4 S4.3 156.9,73.89 151.11,79.68 147.3,79.68 | R9.S R9.A 142.41,42.85 | 144.76,53.04 144.76,41.56 | CON1_ISP.6 79.99,6.02 81.26,7.29 81.26,22.53 79.99,23.8 B1.GND@2 77.45,23.8 76.18,25.07 v76.18,37.77 v76.18,45.39 | 136.96,87.3 135.63,87.3 | D1.2 135.62,86.03 135.69,86.03 136.96,87.3 | 135.62,87.29 135.63,87.3 | C8.2 143.52,54.28 144.76,53.04 | 142.41,42.85 143.47,42.85 144.76,41.56 | 142.41,42.85 142.22,42.66 142.22,40.31 140.95,39.04 128.25,39.04 B1.GND@1 B1.GND@0 118.09,37.77 116.82,36.5 116.82,32.69 115.55,31.42 IC1.31 | 144.76,53.04 144.76,65.71 C4.2 146.03,78.41 147.3,79.68 | 144.76,53.04 144.79,53.04 146.03,54.28 148.64,54.28 149.84,53.08 149.84,53.02 151.08,51.78 RVAR1.B | 147.3,7.29 C6.2 C7.2 139.68,18.72 140.95,19.99 146.03,19.99 147.3,18.72 U$1.GND 147.32,17.43 149.84,14.91 149.84,10.34 U$1.S2 150.02,10.01 147.3,7.29 | 147.3,7.29 C9.- | 95.23,84.76 93.96,83.49 93.96,70.79 92.69,69.52 IC2.4 | v116.82,64.44 115.55,63.17 115.55,61.9 114.28,60.63 v110.47,60.63 v110.47,74.6
  Top 0.254: v121.9,60.63 121.9,58.09 v119.36,55.55
  Top 1.016: 147.3,77.14 151.11,73.33 | 151.11,86.03 147.3,82.22 | 149.84,53.08 149.84,58.09 | 149.84,53.02 149.84,47.93
  Bottom 0.254: C5.2 SPANNUNG.1 149.84,27.56 | IC1.31 105.39,31.42 102.85,28.88 IC1.11 93.96,28.88 92.69,27.61 92.69,25.15 91.34,23.8 B1.GND@2 | 6.33,38.98 6.33,28.88 5.06,27.61 TSL45315.7 20.3,27.61 R20.1 | 6.33,38.98 6.33,82.22 5.06,83.49 | 6.39,39.04 6.33,38.98 | 149.84,27.56 149.84,22.23 150.02,22.06 U$1.S1 150.02,17.5 149.97,17.45 | 149.79,27.61 149.84,27.56 | JP1.2 R21.1 R19.1 R20.1 | R36.1 R22.1 R23.1 R24.1 R20.1 | SPANNUNG.3 154.92,18.72 153.65,17.45 149.97,17.45 | 20.44,82.22 R8.1 | R8.1 20.31,82.21 20.32,82.22 | R18.2 27.92,88.53 25.42,86.03 R34.1 20.24,85.97 | 20.24,85.97 19.03,84.76 6.33,84.76 5.06,83.49 | R8.1 20.3,85.91 20.24,85.97 | BLUETOOTH.3 5.06,83.49 | v76.18,45.39 v71.1,45.39 | v76.18,37.77 v71.1,37.77 | C2.2 101.58,83.49 102.85,82.22 109.2,82.22 110.47,80.95 v110.47,74.6 | v116.82,64.44 118.09,63.17 118.09,61.9 119.36,60.63 v121.9,60.63 | v55.86,73.33 v66.02,73.33 | 149.97,17.45 147.32,17.45 U$1.GND
  other vias: 43.16,36.5
  pour Top (isolate 0.61): 1.25,94.92 5.06,98.73 154.92,98.73 158.73,94.92 158.73,4.75 154.92,0.94 5.06,0.94 1.25,4.75
  pour Bottom (isolate 0.61): 1.25,94.92 5.06,98.73 154.92,98.73 158.73,94.92 158.73,4.75 154.92,0.94 5.06,0.94 1.25,4.75
N$1  (via drill 0.35)
  Top 0.254: R4.1 102.85,87.3 105.39,84.76 110.47,84.76 111.74,83.49 111.74,81.01 | 111.74,81.01 v111.74,80.95 | 111.74,81.01 111.68,80.95 109.2,80.95 105.39,77.14 105.39,11.1 102.85,8.56 IC1.19 95.23,8.56 85.07,18.72 85.07,46.66 83.8,47.93 B1.D5
  Bottom 0.254: v111.74,80.95 111.74,75.87 113.01,74.6 R1.1
N$2
  Top 0.254: IC1.13 97.77,23.8 100.31,26.34 100.31,74.6 Q4.1 C2.1
N$3  (via drill 0.35)
  Top 0.254: 86.34,40.17 86.34,19.99 95.23,11.1 IC1.18 101.58,11.1 104.12,13.64 104.12,78.41 v109.2,83.49 | 86.34,40.17 86.34,40.31 | R5.1 113.01,87.3 114.28,86.03 v114.28,83.49 | B1.D3 85.07,53.01 86.34,51.74 86.34,40.17
  Bottom 0.254: v109.2,83.49 v114.28,83.49 115.55,82.22 R2.1
N$4
  Top 0.254: IC1.12 97.77,26.34 99.04,27.61 99.04,74.6 97.77,75.87 Q4.2 C3.2
N$5
  Top 0.254: R3.1 118.09,78.41 116.82,79.68 116.82,79.75 | 116.82,79.75 R6.1 | 116.82,79.75 115.48,78.41 109.2,78.41 106.66,75.87 106.66,8.56 104.12,6.02 IC1.20 95.23,6.02 83.8,17.45 83.8,44.12 82.53,45.39 B1.D6
N$6
  Bottom 0.254: R1.2 130.79,74.6 132.06,75.87 132.06,78.79 D1.1
N$7
  Bottom 0.254: D1.4 130.28,82.98 R2.2
N$8
  Top 0.254: R3.2 135.11,78.41 D1.3
N$9
  Bottom 0.254: R4.2 96.5,94.92 93.96,92.38 LED1.A
N$10
  Bottom 0.254: R5.2 106.66,94.92 104.12,92.38 LED2.A
N$11
  Bottom 0.254: R6.2 116.82,94.92 114.28,92.38 LED3.A
N$12  (via drill 0.35)
  Top 0.254: v66.02,17.45 CON1_ISP.1 63.48,13.64 41.89,13.64 40.62,12.37 JP1.9 40.62,7.29 | v40.62,44.12 38.08,46.66 R18.1 JP2.2 | SPI.3 53.32,6.02 52.68,6.66 41.25,6.66 40.62,7.29 | 40.62,7.29 PAD13.1
  Bottom 0.254: JP1.9 v40.62,44.12 | IC1.7 91.42,39.04 90.15,37.77 90.15,30.13 88.9,28.88 B1.D12 67.29,28.88 66.02,27.61 v66.02,17.45 | R31.1 R18.1
N$13
  Top 0.254: ADC.1 B1.A5
  Bottom 0.254: IC1.35 120.63,41.58 121.9,42.85 121.9,44.12 123.17,45.39 129.52,45.39 130.79,46.66 130.79,59.36 129.52,60.63 B1.A5
N$14
  Bottom 0.254: IC2.2 78.72,70.79 77.45,72.06 Q2.2
N$15  (via drill 0.35)
  Top 0.254: v63.48,17.45 R27.2
  Bottom 0.254: CON1_ISP.4 67.29,7.29 64.75,7.29 63.48,8.56 v63.48,17.45 63.48,30.15 64.75,31.42 B1.D11 87.2,31.42 88.88,33.1 88.88,40.31 90.15,41.58 IC1.6 | R27.2 58.4,7.29 55.86,4.75 SPI.2
N$16  (via drill 0.35)
  Top 0.254: v55.86,64.44 46.97,64.44 45.7,63.17 45.7,60.63 | 45.7,60.63 45.7,59.36 | 45.7,60.63 R37.2
  Bottom 0.254: v55.86,64.44 113.01,64.44 114.28,63.17 114.28,53.01 113.01,51.74 IC1.39 123.17,51.74 124.44,50.47 B1.A1
N$17  (via drill 0.35)
  Top 0.254: IC1.24 110.47,13.64 109.2,14.91 v109.2,68.25
  Bottom 0.254: v109.2,68.25 88.88,68.25 87.61,69.52 87.61,94.92 86.34,96.19 MPU6050.1
N$18  (via drill 0.35)
  Top 0.254: v137.14,46.66 137.14,50.47 135.87,51.74 130.79,51.74 129.52,53.01 B1.A2 | v119.36,49.2 v119.36,53.01
  Bottom 0.254: RVAR1.S 148.57,54.28 146.03,51.74 138.41,51.74 137.14,50.47 v137.14,46.66 | IC1.38 v119.36,49.2 | v119.36,53.01 B1.A2
N$19
  Top 0.254: IC5_LM317T.1 149.84,40.31 R16.2 R17.1
N$20
  Bottom 0.254: IC2.1 Q2.1
N$21  (via drill 0.35)
  Top 0.254: IC1.14 95.23,21.26 91.42,25.07 91.42,59.36 90.15,60.63 B1.RX | BLUETOOTH.4 v7.6,80.95
  Bottom 0.254: v7.6,80.95 7.6,77.14 8.87,75.87 21.57,75.87 22.84,74.6 22.84,61.87 24.08,60.63 B1.RX
N$22
  Top 0.254: BLUETOOTH.5 R7.1
  Bottom 0.254: R8.2 R7.1
N$23  (via drill 0.35)
  Top 0.254: IC2.6 v81.26,80.21 81.26,84.76 79.99,86.03 78.72,86.03 77.45,87.3 IC4.2 77.45,91.11 76.18,92.38 73.64,92.38 71.1,94.92 MPU6050.6 | v58.4,75.87 v58.4,47.93 58.4,30.15 63.48,25.07 69.63,25.07 71.1,23.6 71.1,17.46 72.38,16.18 B1.SCL | TSL45315.4 12.68,19.99 15.22,22.53 v15.22,42.85
  Bottom 0.254: v81.26,80.21 80.73,79.68 72.37,79.68 68.56,75.87 I2C.1 v58.4,75.87 | v58.4,47.93 17.76,47.93 15.22,45.39 v15.22,42.85 | IC1.22 107.93,8.56 106.66,7.29 106.66,3.43 105.44,2.21 R14.2 87.61,3.48 78.72,12.37 B1.SCL
N$24  (via drill 0.35)
  Top 0.254: v102.85,70.79 102.85,16.18 100.31,13.64 IC1.17 95.23,13.64 87.61,21.26 v87.61,50.47 | B1.D4 v83.8,50.47
  Bottom 0.254: S2.4 133.61,87.58 132.06,86.03 125.71,86.03 124.44,84.76 124.44,73.33 121.9,70.79 v102.85,70.79 | v83.8,50.47 v87.61,50.47
N$25  (via drill 0.35)
  Top 0.254: v101.58,69.52 101.58,18.72 99.04,16.18 IC1.16 95.23,16.18 88.88,22.53 88.88,54.28 87.61,55.55 B1.D2
  Bottom 0.254: v101.58,69.52 124.44,69.52 126.98,72.06 126.98,83.48 128.26,84.76 134.6,84.76 135.87,86.03 135.87,92.38 137.14,93.65 142.22,93.65 143.49,92.38 143.49,90.68 S3.4
N$26
  Top 0.254: R10.2 143.21,97.46 S3.3
N$27
  Top 0.254: R11.2 133.05,97.46 S2.3
N$28
  Top 0.254: R12.2 122.89,97.46 S1.3
N$29  (via drill 0.35)
  Top 0.254: v126.98,12.37 129.4,12.37 130.79,13.76 130.79,16.18 132.06,17.45 C7.1 140.95,23.8 L3.2
  Bottom 0.254: IC1.30 113.01,28.88 114.28,27.61 114.28,14.91 116.82,12.37 v126.98,12.37
N$30  (via drill 0.35)
  Top 0.254: IC1.15 95.23,18.72 90.15,23.8 90.15,56.82 88.88,58.09 B1.TX | R7.2 v20.3,73.33
  Bottom 0.254: v20.3,73.33 20.3,59.36 21.57,58.09 B1.TX
N$31
  Top 0.254: R19.2 R25.1
  Bottom 0.254: R25.1 45.7,18.72 JP1.11
N$32
  Top 0.254: IC1.25 114.28,16.18 115.55,14.91 115.55,4.75 116.82,3.48 JTAG.1
N$33
  Bottom 0.254: R16.1 154.92,40.31 145.09,40.31 144.76,40.31 138.41,40.31 137.14,41.58 R9.E
N$34  (via drill 0.35)
  Top 0.254: R26.1 R20.2 31.73,25.07 30.46,26.34 v30.46,50.47 | JP2.1 v40.62,53.01
  Bottom 0.254: R20.2 35.54,22.53 JP1.7 35.54,7.29 36.81,6.02 41.89,6.02 43.16,7.29 JP1.10 | v40.62,53.01 39.35,51.74 31.73,51.74 v30.46,50.47
N$35
  Top 0.254: R27.1 R21.2 29.19,17.45 27.92,18.72 27.92,77.14 29.19,78.41 34.27,78.41 35.54,79.68 JP2.3
  Bottom 0.254: R21.2 JP1.6 | JP1.12 R27.1
N$36
  Top 0.254: R22.2 R28.1
  Bottom 0.254: R22.2 26.65,39.04 25.38,37.77 JP1.3
N$37
  Top 0.254: R23.2 R29.1
  Bottom 0.254: JP1.4 27.92,32.69 29.19,33.96 R23.2
N$38
  Top 0.254: R24.2 R30.1
  Bottom 0.254: R24.2 31.73,30.15 30.46,28.88 JP1.5
N$39  (via drill 0.35)
  Top 0.254: v110.47,58.09 v115.55,58.09 | SW1.A 143.61,83.37 142.22,84.76 R33.2 139.68,77.14 143.49,73.33 143.49,69.52 142.22,68.25 142.22,59.36 140.95,58.09 B1.A4
  Bottom 0.254: v110.47,58.09 107.93,55.55 107.93,46.66 110.47,44.12 IC1.36 | v115.55,58.09 B1.A4
N$40  (via drill 0.35)
  Top 0.254: v91.42,61.9 91.42,63.17 90.15,64.44 76.18,64.44 74.91,63.17 v74.91,61.9 | v48.24,44.12 v48.24,61.9
  Bottom 0.254: R25.2 50.78,21.26 48.24,23.8 v48.24,44.12 | v91.42,61.9 91.42,55.55 92.69,54.28 IC1.1 | v48.24,61.9 v74.91,61.9
N$41
  Bottom 0.254: IC1.3 83.8,49.2 82.53,47.93 82.53,40.42 81.15,39.04 B1.D8 R28.2
N$42  (via drill 0.35)
  Top 0.254: v50.78,44.12 v50.78,63.17 | IC1.40 v115.55,54.28 | B1.A0 125.71,47.93 124.44,49.2 v124.44,54.28
  Bottom 0.254: R29.2 50.78,36.5 v50.78,44.12 | v50.78,63.17 110.47,63.17 111.74,61.9 IC1.40 | v115.55,54.28 v124.44,54.28
N$43
  Bottom 0.254: IC1.4 85.07,46.66 83.8,45.39 83.8,38 82.31,36.5 B1.D9 58.4,36.5 57.13,35.23 57.13,31.42 55.86,30.15 R30.2
N$44  (via drill 0.35)
  Top 0.254: SW1.B 143.61,75.75 144.76,74.6 144.76,68.24 143.49,66.97 143.49,58.09 142.22,56.82 130.79,56.82 129.52,55.55 B1.A3 123.17,55.55 121.9,54.28 v121.9,46.66
  Bottom 0.254: 143.57,77.14 SW1.B 138.45,77.18 137.14,75.87 137.14,72.06 135.87,70.79 R32.2 | IC1.37 v121.9,46.66
N$45
  Top 0.254: R34.2 R35.1 JP2.4
N$46  (via drill 0.35)
  Top 0.254: v96.5,60.63 v96.5,70.79 | v86.34,74.6 v90.15,74.6
  Bottom 0.254: IC1.2 97.77,51.74 99.04,53.01 99.04,56.82 96.5,59.36 v96.5,60.63 | v96.5,70.79 91.42,70.79 90.15,72.06 v90.15,74.6 | R35.2 43.16,72.06 44.43,70.79 66.02,70.79 69.83,74.6 v86.34,74.6
N$47
  Top 0.254: JTAG.2 134.6,4.75 133.33,6.02 119.36,6.02 118.09,7.29 118.09,17.45 116.82,18.72 IC1.26
N$48
  Top 0.254: IC1.27 119.36,21.26 120.63,19.99 120.63,8.56 121.9,7.29 135.87,7.29 137.14,6.02 JTAG.3
N$49
  Top 0.254: JTAG.4 139.68,7.29 138.41,8.56 124.44,8.56 123.17,9.83 123.17,22.53 121.9,23.8 IC1.28
N$50  (via drill 0.35)
  Top 0.254: v67.29,19.99 57.12,19.99 v55.85,18.72
  Bottom 0.254: CON1_ISP.3 67.29,9.83 v67.29,19.99 67.29,25.07 68.56,26.34 B1.D13 90.01,26.34 91.42,27.75 91.42,35.23 92.69,36.5 IC1.8 | R26.2 54.59,25.07 55.85,23.81 v55.85,18.72 55.86,17.44 55.86,7.29 54.59,6.02 52.13,6.02 52.09,6.06 50.78,4.75 SPI.4
N$52
  Bottom 0.254: SPI.1 59.67,4.75 59.67,32.69 60.94,33.96 B1.D10 86,33.96 87.61,35.57 87.61,42.85 88.88,44.12 IC1.5
N$53  (via drill 0.35)
  Top 0.254: 107.93,4.75 v107.93,72.06 | 107.93,4.75 106.67,3.48 93.96,3.48 82.53,14.91 82.53,41.58 81.26,42.85 B1.D7 | IC1.21 109.2,6.02 107.93,4.75
  Bottom 0.254: S1.4 123.45,86.31 121.9,84.76 121.9,73.33 120.63,72.06 v107.93,72.06
N$54
  Top 0.254: JTAG.5 142.22,7.29 | 142.22,7.29 142.22,8.56 | IC1.29 123.17,26.34 124.44,25.07 124.44,11.1 125.71,9.83 140.95,9.83 142.22,8.56 | 142.22,7.29 142.22,8.56
N$55
  Bottom 0.254: PAD4.1 PAD2.1 B1.IOREF 125.71,27.61 124.44,28.88 124.44,41.58 125.71,42.85 B1.VIN
N$56
  Top 0.254: 133.33,35.23 134.6,35.23 | 134.6,35.23 PAD6.1 | 134.6,35.23 B1.5V
N$57
  Top 0.254: PAD8.1 B1.3.3V
N$58
  Top 0.254: PAD12.1 PAD10.1 72.37,41.58 73.64,40.31 73.64,22.5 74.88,21.26 B1.AREF
N$59
  Top 0.254: IC1.34 113.01,39.04 114.28,40.31 114.28,50.47 116.82,53.01 116.82,60.63 119.36,63.17 ADC.2
N$60  (via drill 0.35)
  Top 0.254: IC1.33 113.01,36.5 115.55,39.04 115.55,49.2 118.09,51.74 118.09,59.36 120.63,61.9 v135.87,61.9
  Bottom 0.254: v135.87,61.9 135.87,64.44 137.14,65.71 ADC.3
N$61
  Bottom 0.254: JP1.13 50.78,7.29 46.97,3.48 PAD14.1
N$62  (via drill 0.35)
  Top 0.254: IC1.9 95.23,33.96 93.96,35.23 v93.96,66.9 | v62.21,23.8 55.86,30.15 v55.86,51.74 | S4.2 S4.1 | v132.06,54.28 C8.1 | v64.75,68.25 R15.1
  Bottom 0.254: v55.86,51.74 R15.1 | C8.1 137.14,55.55 138.41,56.82 144.53,56.82 146.03,58.32 C4.1 | v62.21,23.8 62.21,7.29 63.48,6.02 CON1_ISP.5 | C4.1 144.76,61.9 143.49,63.17 143.49,66.98 142.22,68.25 133.33,68.25 132.06,66.98 93.97,66.98 93.89,66.9 | S4.2 147.58,64.72 146.03,63.17 C4.1 | 93.89,66.9 66.1,66.9 v64.75,68.25 | 93.89,66.9 v93.96,66.9 | B1.RES 130.79,30.15 132.06,31.42 v132.06,54.28
N$63
  Top 0.254: R37.1 R36.2
  Bottom 0.254: R37.1 45.7,22.53 53.32,14.91 JP1.14
N$64  (via drill 0.35)
  Top 0.254: v60.94,78.27 v60.94,45.26 60.94,30.15 63.48,27.61 71.1,27.61 72.37,26.34 72.37,20.07 73.72,18.72 B1.SDA | IC2.5 v83.8,84.93 83.8,87.3 82.33,88.77 IC4.1 78.72,92.38 77.45,93.65 74.91,93.65 73.64,94.92 MPU6050.5 | TSL45315.3 15.22,17.45 17.76,19.99 v17.76,40.31
  Bottom 0.254: v83.8,84.93 79.82,80.95 71.1,80.95 68.56,78.41 I2C.2 63.48,78.41 | 90.15,4.71 R13.2 | 90.15,4.71 91.38,3.48 102.74,3.48 104.12,4.86 104.12,9.83 105.39,11.1 IC1.23 | 63.48,78.41 62.35,78.41 | v17.76,40.31 17.76,42.85 20.3,45.39 60.81,45.39 v60.94,45.26 | B1.SDA 79.99,18.72 81.26,17.45 81.26,13.6 90.15,4.71 | 63.48,78.41 61.08,78.41 v60.94,78.27

### Text on the board
Top: TBS1 ÜBUNGSBOARD 2017
tValues: 3.3V | GND | SCL | SDA | PC2 | 5V | GND | GND | 3.3V | RX | 5V | TX | SDA | SCL | PA7 | PA6 | PA5 | 5V | 3.3V | AREF | 5V | 5V | 3.3.V | 3.3.V | GND | IOREF / VIN | 5V | GND | 3.3V | GND | 5V | 5V | SCL | SDA | PC3 | PC4 | PC5 | PC6 | PC7 | SCK | MISO | MOSI | SS